# Altium schematic sheet Torque_Signal_Conditioning.SchDoc
size A4; CompanyName: Technische Hochschule Nürnberg Georg Simon Ohm; Organization: UltraZohm; Address1: Kesslerplatz 12; Address2: 90489 Nürnberg; Address3: GERMANY; DocumentNumber: 2; SheetNumber: 2; SheetTotal: 2; Website: www.ultrazohm.com
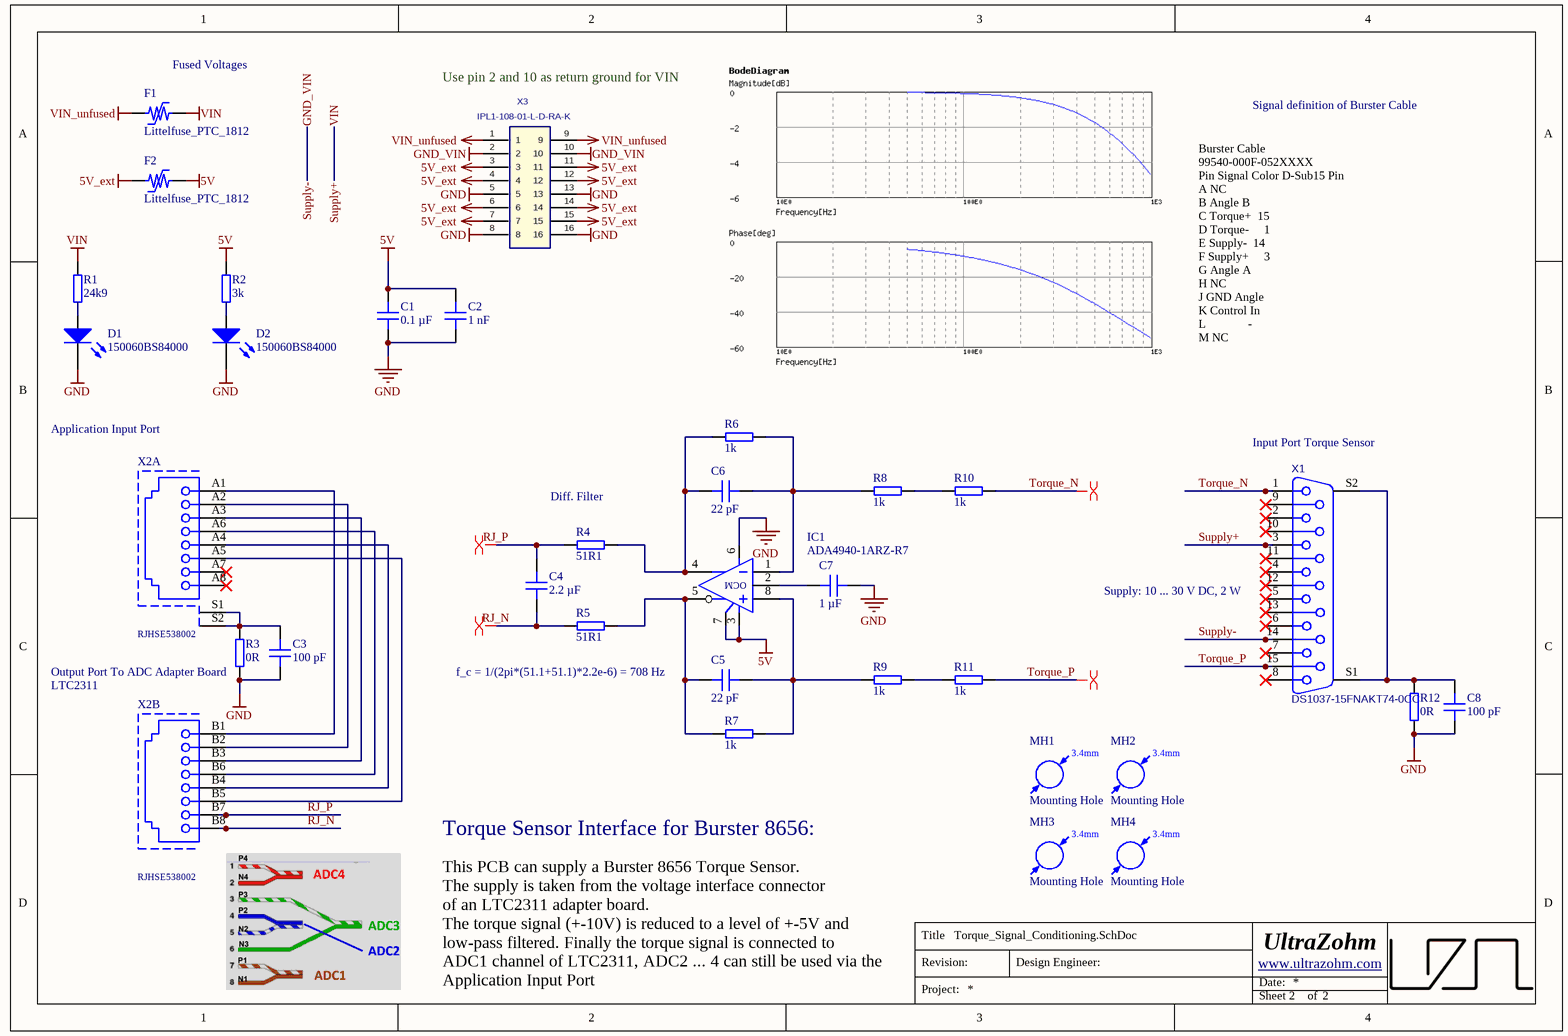
[diagram p0: Torque_Signal_Conditioning.SchDoc]

## Parts
C1  0.1 µF  [C_0603]
C2  1 nF  [C_0603]
C3  100 pF  [C_1206]
C4  2.2 µF  [C_0805]
C5  22 pF  [C_0603]
C6  22 pF  [C_0603]
C7  1 µF  [C_0603]
C8  100 pF  [C_1206]
D1  150060BS84000  [WL-SMCW_0603]
D2  150060BS84000  [WL-SMCW_0603]
F1  Littelfuse_PTC_1812  [1812_PTC_Polyfuse_Littelfuse]
F2  Littelfuse_PTC_1812  [1812_PTC_Polyfuse_Littelfuse]
IC1  ADA4940-1ARZ-R7  [SOIC-8-N]
MH1  Mounting Hole  [MH_3.4]
MH2  Mounting Hole  [MH_3.4]
MH3  Mounting Hole  [MH_3.4]
MH4  Mounting Hole  [MH_3.4]
R1  24k9  [RES 0603_1608]
R2  3k  [RES 0603_1608]
R3  0R  [RES 1206_3216]
R4  51R1  [RES 0603_1608]
R5  51R1  [RES 0603_1608]
R6  1k  [RES 0603_1608]
R7  1k  [RES 0603_1608]
R8  1k  [RES 0603_1608]
R9  1k  [RES 0603_1608]
R10  1k  [RES 0603_1608]
R11  1k  [RES 0603_1608]
R12  0R  [RES 1206_3216]
X1  DS1037-15FNAKT74-0CC  [PCB - MISC - DSUB15]
X2  RJHSE538002  [RJHSE-5380-02]  (parts A,B of 2)
X3  IPL1-108-01-L-D-RA-K  [IPL1-108-01-L-D-RA-K]

## Nets
5V: C1.2 C2.2 F2.2 IC1.3(V+) IC1.7(EN) R2.2
5V_ext: F2.1 X3.3 X3.4 X3.6 X3.7 X3.11 X3.12 X3.14 X3.15
GND: C1.1 C2.1 C3.1 C7.1 C8.1 D1.1(K) D2.1(K) IC1.6(V-) R3.1 R12.1 X3.5 X3.8 X3.13 X3.16
GND_VIN: X1.14 X3.2 X3.10  [also labelled Supply-]
Supply+: F1.2 R1.2 X1.3  [also labelled VIN]
VIN_unfused: F1.1 X3.1 X3.9
RJ_N: C4.1 R5.1 X2.B8
RJ_P: C4.2 R4.1 X2.B7
Torque_N: R10.2 X1.1
Torque_P: R11.2 X1.15
NetC3_2: C3.2 R3.2 X2.S1 X2.S2
NetC5_1: C5.1 IC1.8(+) R7.2 R9.1
NetC5_2: C5.2 IC1.5(Out) R5.2 R7.1
NetC6_1: C6.1 IC1.1(-) R6.2 R8.1
NetC6_2: C6.2 IC1.4(Out) R4.2 R6.1
NetC7_2: C7.2 IC1.2(OCM)
NetC8_2: C8.2 R12.2 X1.S1(MH1) X1.S2(MH2)
NetD1_2: D1.2(A) R1.1
NetD2_2: D2.2(A) R2.1
NetR8_2: R8.2 R10.1
NetR9_2: R9.2 R11.1
NetX2_A1: X2.A1 X2.B1
NetX2_A2: X2.A2 X2.B2
NetX2_A3: X2.A3 X2.B3
NetX2_A4: X2.A4 X2.B4
NetX2_A5: X2.A5 X2.B5
NetX2_A6: X2.A6 X2.B6

Not connected (* = marked no-connect by the designer): X1 2* 4* 5* 6* 7* 8* 9* 10* 11* 12* 13*; X2 A7* A8*

## Layout directives
differential pair: RJ_N, RJ_P, Torque_N, Torque_P

## Notes on the sheet
- (near F1) Fused Voltages
- Use pin 2 and 10 as return ground for VIN
- Signal definition of Burster Cable
- Burster Cable
  99540-000F-052XXXX
  Pin	Signal	Color	D-Sub15 Pin
  A	NC
  B	Angle B
  C	Torque+		15
  D	Torque- 		  1
  E	Supply-		14
  F	Supply+ 		  3
  G	Angle A
  H	NC
  J	GND Angle
  K	Control In
  L              -
  M	NC
- Application Input Port
- (near X1) Input Port Torque Sensor
- (near R4) Diff. Filter
- (near X1) Supply: 10 ... 30 V DC, 2 W
- (near R3) Output Port To ADC Adapter Board
- LTC2311
- (near C5) f_c = 1/(2pi*(51.1+51.1)*2.2e-6) = 708 Hz
- Torque Sensor Interface for Burster 8656:
- This PCB can supply a Burster 8656 Torque Sensor.
  The supply is taken from the voltage interface connector
  of an LTC2311 adapter board.
  The torque signal (+-10V) is reduced to a level of +-5V and
  low-pass filtered. Finally the torque signal is connected to
  ADC1 channel of LTC2311, ADC2 ... 4 can still be used via the
  Application Input Port
- Title
- Revision:
- Design Engineer:
- Date:
- Project:
- Sheet
- of
- (in symbol Mounting Hole) 3.4mm

## Library data of the parts
C1 = C0603X104K5RAC7411: Capacitor 0603, 50 VDC, 0.1 µF, X7R; Manufacturer: KEMET; Tolerance: 10 %; Voltage Rating: 50 VDC; Created from: MGremer; Manufacturer Part Number: C0603X104K5RAC7411; PartID: 3; Created On: 20.12.2020 13:54:13; ComponentLink1Description: Datasheet; ComponentLink1URL: https://www.mouser.de/datasheet/2/212/1/KEM_C1013_X7R_FT_CAP_SMD-1103280.pdf; Component Type: Capacitor 0603; Device Package: 0603; Last Updated: 04.03.2021 09:24:28; Mounting Type: SMD; Operating Temperature: -55 - 125°C; Series: SMD Comm X7R Flex; Supplier 1: Mouser; Supplier Part Number 1: 80-C0603X104K5R7411; Supplier 2: LCSC; Supplier Part Number 2: C14663; Type: Capacitor; Value: 0.1 µF; Live Cycle Status: 1; LCSC Part Number: C14663; Stock number: Labor SMD Container
C2 = CC0603JRNPO9BN102: Capacitor 0603, 50 VDC, 1 nF, NP0; Manufacturer: YAGEO; Tolerance: 5 %; Voltage Rating: 50 VDC; Created from: AGeiger; Manufacturer Part Number: CC0603JRNPO9BN102; PartID: 104; Created On: 30.08.2022 11:46:28; ComponentLink1Description: Datasheet; ComponentLink1URL: https://datasheet.lcsc.com/lcsc/1811021411_YAGEO-CC0603JRNPO9BN102_C106246.pdf; Component Type: Capacitor 0603; Device Package: 0603; Last Updated: 30.08.2022 11:46:28; Mounting Type: SMD; Operating Temperature: -55 - 125°C; Series: NP0; Supplier 1: LCSC; Supplier Part Number 1: C106246; Type: Capacitor; Value: 1 nF; Live Cycle Status: 1; LCSC Part Number: C106246
C3 C8 = 885342008009: Capacitor 1206, 1 kVDC, 100 pF, C0G; Manufacturer: Wuerth Elektronik; Tolerance: 5 %; Voltage Rating: 1 kVDC; Created from: MGremer; Manufacturer Part Number: 885342008009; PartID: 62; Created On: 20.12.2020 13:54:13; ComponentLink1Description: Datasheet; ComponentLink1URL: https://www.mouser.de/datasheet/2/445/885342008009-1727900.pdf; Component Type: Capacitor 1206; Device Package: 1206; Last Updated: 20.12.2020 17:44:37; Mounting Type: SMD; Operating Temperature: -55 - 125°C; Series: WCAP-CSMH; Supplier 1: Mouser; Supplier Part Number 1: 710-885342008009; Type: Capacitor; Value: 100 pF; Live Cycle Status: 1; Stock number: Labor SMD Container
C4 = C0805X225J4RECAUTO: Capacitor 0805, 16 VDC, 2.2 µF, X7R; Manufacturer: KEMET; Tolerance: 5 %; Voltage Rating: 16 VDC; Created from: MGremer; Manufacturer Part Number: C0805X225J4RECAUTO; PartID: 79; Created On: 20.12.2020 13:54:13; ComponentLink1Description: Datasheet; ComponentLink1URL: https://www.mouser.de/datasheet/2/212/1/KEM_C1090_X7R_ESD-1103328.pdf; Component Type: Capacitor 0805; Device Package: 0805; Last Updated: 20.12.2020 16:34:30; Mounting Type: SMD; Operating Temperature: -55 - 125°C; Series: CC; Supplier 1: Mouser; Supplier Part Number 1: 80-C0805X225J4RECAUT; Type: Capacitor; Value: 2.2 µF; Live Cycle Status: 1; Stock number: Labor SMD Container
C5 C6 = C0603C220J5RACTU: Capacitor 0603, 50 VDC, 22 pF, X7R; Manufacturer: KEMET; Tolerance: 5 %; Voltage Rating: 50 VDC; Created from: MGremer; Manufacturer Part Number: C0603C220J5RACTU; PartID: 78; Created On: 20.12.2020 13:54:13; ComponentLink1Description: Datasheet; ComponentLink1URL: https://www.mouser.de/datasheet/2/212/KEM_C1002_X7R_SMD-1102033.pdf; Component Type: Capacitor 0603; Device Package: 0603; Last Updated: 20.01.2021 13:57:36; Mounting Type: SMD; Operating Temperature: -55 - 125°C; Series: SMD Comm X7R; Supplier 1: Mouser; Supplier Part Number 1: 80-C0603C220J5R; Type: Capacitor; Value: 22 pF; Live Cycle Status: 1; Stock number: not stored
C7 = UMK107AB7105KA-T: 50V 1uF X7R ±10% 0603 Multilayer Ceramic Capacitors MLCC - SMD/SMT ROHS; Manufacturer: Taiyo Yuden; Voltage Rating: 50 VDC; Created from: NDiringer; Manufacturer Part Number: UMK107AB7105KA-T; PartID: 98; Created On: 09.08.2022 09:35:02; ComponentLink1Description: Datasheet; ComponentLink1URL: https://www.mouser.de/datasheet/2/396/mlcc02_e-1307760.pdf; Component Type: Capacitor 0603; Device Package: 0603; Last Updated: 21.09.2022 16:11:37; Mounting Type: SMD; Operating Temperature: -55 - 125°C; Series: X7R; Supplier 1: LCSC; Supplier Part Number 1: C105174; Supplier 2: Mouser; Supplier Part Number 2: 963-UMK107AB7105MA-T; Type: Capacitor; Tolerance: 10 %; Value: 1 µF; Live Cycle Status: 1; LCSC Part Number: C105174; Stock number: not stored
D1 D2 = 150060BS84000: WL-SMCW SMD Mono-color Chip LED Waterclear Blue; Manufacturer: Wuerth Elektronik; Type: Standard; Created from: MGremer; Forward Current I_f: 20 mA; Forward Voltage U_f: 3.2 V; Wavelength: 470 nm; Light Intensity: 560 mcd; Nominal Power: 78 mW; Manufacturer Part Number: 150060BS84000; PartID: 1; Created On: 08.12.2020 10:19:38; ComponentLink1Description: Datasheet; ComponentLink1URL: https://www.mouser.de/datasheet/2/445/150060BS84000-1838909.pdf; Component Type: LED Diode; Device Package: 0603; Mounting Type: SMD; Operating Temperature: -40 - 85 °C; Supplier 1: Mouser; Supplier Part Number 1: 710-150060BS84000; Supplier 2: Farnell; Supplier Part Number 2: 3408611; Supplier 3: Digi-Key; Supplier Part Number 3: 732-150060BS84000CT-ND; Live Cycle Status: 1; Stock number: not stored; Color: blue
  D1: Last Updated: 03.03.2021 09:59:51
  D2: Last Updated: 21.02.2024 14:46:49; LCSC Part Number: C5197644
F1 F2 = Littelfuse_PTC_1812: POLYSWITCH RESETTABLE DEVICES; MPN: miniASMDC110F/24; Value: PTC, 1.1 A, 24V; Voltage: 24V; Trip Current: 2.2A; Hold Current: 1.1A; Resistance: 0.18 Ohm; Type: Fuse; Nominal current: 1 A; Created from: MHlatky; MF: Littelfuse; Created: 2019_02_10_AGeiger; Package: 1812; ComponentLink1URL: https://www.littelfuse.com/~/media/electronics/datasheets/resettable_ptcs/littelfuse_ptc_surface_mount_catalog_datasheet.pdf.pdf; ComponentLink1Description: Datasheet; Manufacturer Part Number: Littelfuse_PTC_1812; PartID: 5; Created On: 07.05.2021 06:50:33; Component Type: Littelfuse_PTC_1812; Last Updated: 27.05.2022 15:06:17; Manufacturer: Littelfuse; Mounting Type: SMD; Operating Temperature: -40 - 85 °C; Supplier 1: Mouser; Supplier Part Number 1: 530-0ZCG0150BF2C; Live Cycle Status: 1; LCSC Part Number: C70119
IC1 = ADA4940-1ARZ-R7: Differential ADC Driver; Manufacturer: Analog Devices; Class I: Analog; Class II: Fully Differential ADC Drivers (-40-125°C); Best.-Nr.: Farnell 209-6178; Channels: 1; Created from: MGremer; Datasheet: DSO11449, Ver. Aug 2000; Last edited: 04.01.2007 10:14; Package Reference: SOIC-N-8; Manufacturer Part Number: ADA4940-1ARZ-R7; PartID: 3; Created On: 15.01.2021 12:16:53; ComponentLink1Description: Datasheet; ComponentLink1URL: https://www.mouser.de/datasheet/2/609/ADA4940-1_4940-2-878284.pdf; Component Type: ADC; Device Package: SOIC-8; Last Updated: 22.11.2021 15:19:18; Mounting Type: SMD; Operating Temperature: -40 - 105 °C; Supplier 1: Mouser; Supplier Part Number 1: 584-ADA4940-1ARZ-R7; Type: ADC; Resolution: -; Value: differential ADC driver; Live Cycle Status: 1; Stock number: not stored
MH1-MH4 = Mounting Hole: Created from: MHlatky; Manufacturer Part Number: Mounting Hole; PartID: 16; Created On: 26.01.2021 09:19:51; ComponentLink1Description: Datasheet; Component Type: Mounting Hole; Device Package: -; Last Updated: 21.03.2022 23:05:12; Manufacturer: Mounting Hole; Supplier 1: Mounting Hole; Supplier Part Number 1: Mounting Hole; Type: Mounting Hole; Value: Mounting Hole; Live Cycle Status: 1; Stock number: not stored
R1 = CRCW060324K9FKEA: SMD resistor 1%; Manufacturer: Vishay; Created from: MGremer; Manufacturer Part Number: CRCW060324K9FKEA; PartID: 157; Created On: 14.12.2020 16:17:14; ComponentLink1Description: Datasheet; ComponentLink1URL: https://www.mouser.de/datasheet/2/427/dcrcwe3-1762152.pdf; Component Type: SMD resistor; Device Package: 0603; Last Updated: 02.03.2021 14:07:32; Mounting Type: SMD; Supplier 1: Mouser; Supplier Part Number 1: 71-CRCW0603-24.9K-E3; Type: Resistor; Tolerance: 1%; Value: 24k9; Live Cycle Status: 1; Stock number: not stored
R2 = RK73B1JTTD302J: SMD resistor E24 series; Manufacturer: KOA Speer; Tolerance: 5%; Created from: MGremer; Manufacturer Part Number: RK73B1JTTD302J; PartID: 85; Created On: 14.12.2020 16:17:14; ComponentLink1Description: Datasheet; ComponentLink1URL: https://www.mouser.de/datasheet/2/219/RK73B-1825463.pdf; Component Type: SMD resistor; Device Package: 0603; Last Updated: 02.03.2021 14:07:32; Mounting Type: SMD; Supplier 1: Mouser; Supplier Part Number 1: 660-RK73B1JTTD302J; Type: Resistor; Value: 3k; Live Cycle Status: 1; Stock number: Labor SMD Container
R3 R12 = 1206W4F0000T5E: 250mW Thick Film Resistors ±800ppm/℃ ±1% 0Ω 1206 Chip Resistor - Surface Mount ROHS; Manufacturer: UNI-ROYAL; Created from: AGeiger; Manufacturer Part Number: 1206W4F0000T5E; PartID: 271; Created On: 06.06.2023 20:12:49; ComponentLink1Description: Datasheet; ComponentLink1URL: https://datasheet.lcsc.com/lcsc/2206010200_UNI-ROYAL-Uniroyal-Elec-1206W4F0000T5E_C17888.pdf; Component Type: SMD resistor; Device Package: 1206; Last Updated: 06.06.2023 20:12:49; Mounting Type: SMD; Supplier 1: LCSC; Supplier Part Number 1: C17888; Type: Resistor; Tolerance: 1%; Value: 0R; Live Cycle Status: 1; LCSC Part Number: C17888
R4 R5 = RT0603BRD0751R1L: SMD resistor 0.1%; Manufacturer: YAGEO; Created from: DHufnagel; Manufacturer Part Number: RT0603BRD0751R1L; PartID: 212; Created On: 14.12.2020 16:17:14; ComponentLink1Description: Datasheet; ComponentLink1URL: https://www.mouser.de/datasheet/2/447/PYu_RT_1_to_0_01_RoHS_L_11-1669912.pdf; Component Type: SMD resistor; Device Package: 0603; Last Updated: 07.06.2024 22:56:33; Mounting Type: SMD; Supplier 1: Mouser; Supplier Part Number 1: 603-RT0603BRD0751R1L; Type: Resistor; Tolerance: 0.1%; Value: 51R1; Live Cycle Status: 1; Stock number: not stored; LCSC Part Number: C2684558
R6-R11 = PCF-W0603LF-03-1001-B-P-LT: SMD resistor 0.1%; Manufacturer: IRC / TT Electronics; Created from: MGremer; Manufacturer Part Number: PCF-W0603LF-03-1001-B-P-LT; PartID: 163; Created On: 14.12.2020 16:17:14; ComponentLink1Description: Datasheet; ComponentLink1URL: https://www.mouser.de/datasheet/2/414/PCF-1528243.pdf; Component Type: SMD resistor; Device Package: 0603; Last Updated: 21.02.2024 15:45:55; Mounting Type: SMD; Supplier 1: Mouser; Supplier Part Number 1: 66-PCFW0603LF031001B; Type: Resistor; Tolerance: 0.1%; Value: 1k; Live Cycle Status: 1; Stock number: not stored; LCSC Part Number: C110776
X1 = DS1037-15FNAKT74-0CC: 15 Female D-Sub Shrouded 2 3A -40℃~+85℃ Plugin D-Sub/DVI/HDMI Connectors ROHS; BOM_Manufacturer: Nextron(台湾正凌); Manufacturer: CONNFLY Elec; Contributor: LCSC; Created from: FRosner; BOM_Supplier: LCSC; BOM_Supplier Part: C2846090; BOM_Manufacturer Part: SUB-DRBF-607A-002; BOM_JLCPCB Part Class: Extended Part; spicePre: D; spiceSymbolName: SUB-DRBF-607A-002; Manufacturer Part Number: DS1037-15FNAKT74-0CC; PartID: 10; Created On: 17.03.2023 15:40:49; ComponentLink1Description: Datasheet; ComponentLink1URL: https://jlcpcb.com/partdetail/ConnflyElec-DS1037_15FNAKT740CC/C77835; Component Type: DSUB 15 pole female; Device Package: THT; Last Updated: 04.05.2023 15:17:49; Mounting Type: THT; Operating Temperature: -40℃+105℃; Supplier 1: LCSC; Supplier Part Number 1: C77835; Type: DSUB 15 pole; Live Cycle Status: 1; LCSC Part Number: C77835; Stock number: not stored
X2 = RJHSE538002: CAT5, RJ45 Connector, 1x2; Manufacturer: Amphenol; Created from: MGremer; Manufacturer Part Number: RJHSE538002; PartID: 4; Created On: 22.02.2021 16:43:38; ComponentLink1Description: Datasheet; ComponentLink1URL: https://www.farnell.com/cad/2360382.pdf; Component Type: RJ45 Connector; Device Package: RJ45; Last Updated: 22.02.2021 16:43:38; Mounting Type: THT; Series: RJHSE; Supplier 1: Farnell; Supplier Part Number 1: 1860605; Type: RJ45 Connector; Live Cycle Status: 1; Stock number: not stored
X3 = IPL1-108-01-L-D-RA-K: 2.54 mm Double Row Termin Assembly (right angle); Manufacturer: SAMTEC; Created from: MGremer; Number of positions: 8; Manufacturer Part Number: IPL1-108-01-L-D-RA-K; PartID: 17; Created On: 30.11.2020 10:36:28; ComponentLink1Description: Homepage; ComponentLink1URL: https://www.samtec.com/products/ipl1; Component Type: Samtec Connector; Device Package: Connector; Last Updated: 15.02.2021 09:17:39; Mounting Type: THT; Supplier 1: SAMTEC; Supplier Part Number 1: IPL1-108-01-L-D-RA-K; Type: Connector; Live Cycle Status: 1; Number of rows: 2; Stock number: not stored